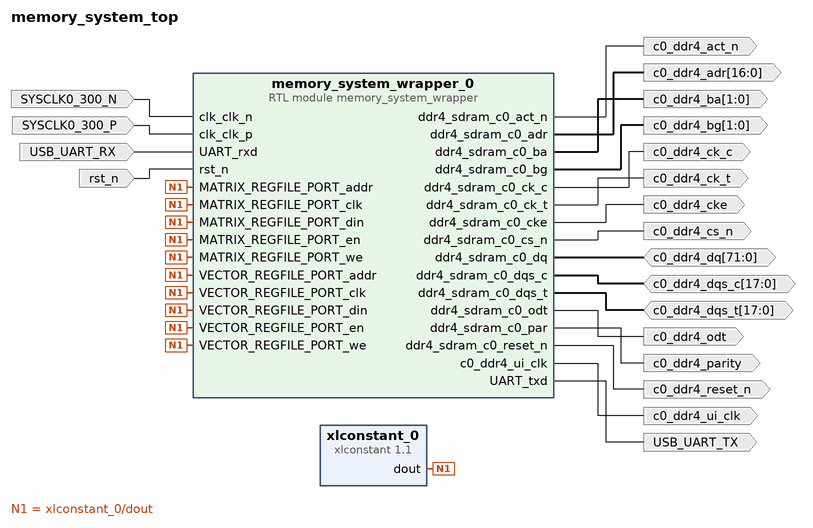
[diagram p0: block diagram of the top level]
# Vivado block design memory_system_top, xcu250-figd2104-2L-e, Vivado 2024.1
create_bd_design memory_system_top

create_bd_port -dir I USB_UART_RX
create_bd_port -dir O USB_UART_TX
create_bd_port -dir I -type clk SYSCLK0_300_N
set_property -dict {CONFIG.ASSOCIATED_RESET rst_n CONFIG.FREQ_HZ 300000000} [get_bd_ports SYSCLK0_300_N]
create_bd_port -dir I -type clk SYSCLK0_300_P
set_property -dict {CONFIG.ASSOCIATED_RESET rst_n:rst_n CONFIG.FREQ_HZ 300000000} [get_bd_ports SYSCLK0_300_P]
create_bd_port -dir I -type rst rst_n
create_bd_port -dir IO -from 71 -to 0 c0_ddr4_dq
create_bd_port -dir IO -from 17 -to 0 c0_ddr4_dqs_c
create_bd_port -dir O c0_ddr4_parity
create_bd_port -dir O c0_ddr4_reset_n
create_bd_port -dir O -from 1 -to 0 c0_ddr4_ba
create_bd_port -dir O -from 1 -to 0 c0_ddr4_bg
create_bd_port -dir O c0_ddr4_cke
create_bd_port -dir O -from 16 -to 0 c0_ddr4_adr
create_bd_port -dir O c0_ddr4_cs_n
create_bd_port -dir O c0_ddr4_ck_c
create_bd_port -dir O c0_ddr4_ck_t
create_bd_port -dir O c0_ddr4_odt
create_bd_port -dir IO -from 17 -to 0 c0_ddr4_dqs_t
create_bd_port -dir O c0_ddr4_act_n
create_bd_port -dir O -type clk c0_ddr4_ui_clk

create_bd_cell -type ip -vlnv xilinx.com:ip:xlconstant:1.1 xlconstant_0
set_property -dict {CONFIG.CONST_VAL 0 CONFIG.CONST_WIDTH 4096} [get_bd_cells xlconstant_0]
create_bd_cell -type module -reference memory_system_wrapper memory_system_wrapper_0

# ---- connections ----

connect_bd_net [get_bd_ports c0_ddr4_dq] [get_bd_pins memory_system_wrapper_0/ddr4_sdram_c0_dq]
connect_bd_net [get_bd_ports c0_ddr4_dqs_c] [get_bd_pins memory_system_wrapper_0/ddr4_sdram_c0_dqs_c]
connect_bd_net [get_bd_ports c0_ddr4_dqs_t] [get_bd_pins memory_system_wrapper_0/ddr4_sdram_c0_dqs_t]
connect_bd_net [get_bd_ports SYSCLK0_300_N] [get_bd_pins memory_system_wrapper_0/clk_clk_n]
connect_bd_net [get_bd_ports SYSCLK0_300_P] [get_bd_pins memory_system_wrapper_0/clk_clk_p]
connect_bd_net [get_bd_ports USB_UART_RX] [get_bd_pins memory_system_wrapper_0/UART_rxd]
connect_bd_net [get_bd_pins memory_system_wrapper_0/UART_txd] [get_bd_ports USB_UART_TX]
connect_bd_net [get_bd_pins memory_system_wrapper_0/c0_ddr4_ui_clk] [get_bd_ports c0_ddr4_ui_clk]
connect_bd_net [get_bd_pins memory_system_wrapper_0/ddr4_sdram_c0_act_n] [get_bd_ports c0_ddr4_act_n]
connect_bd_net [get_bd_pins memory_system_wrapper_0/ddr4_sdram_c0_adr] [get_bd_ports c0_ddr4_adr]
connect_bd_net [get_bd_pins memory_system_wrapper_0/ddr4_sdram_c0_ba] [get_bd_ports c0_ddr4_ba]
connect_bd_net [get_bd_pins memory_system_wrapper_0/ddr4_sdram_c0_bg] [get_bd_ports c0_ddr4_bg]
connect_bd_net [get_bd_pins memory_system_wrapper_0/ddr4_sdram_c0_ck_c] [get_bd_ports c0_ddr4_ck_c]
connect_bd_net [get_bd_pins memory_system_wrapper_0/ddr4_sdram_c0_ck_t] [get_bd_ports c0_ddr4_ck_t]
connect_bd_net [get_bd_pins memory_system_wrapper_0/ddr4_sdram_c0_cke] [get_bd_ports c0_ddr4_cke]
connect_bd_net [get_bd_pins memory_system_wrapper_0/ddr4_sdram_c0_cs_n] [get_bd_ports c0_ddr4_cs_n]
connect_bd_net [get_bd_pins memory_system_wrapper_0/ddr4_sdram_c0_odt] [get_bd_ports c0_ddr4_odt]
connect_bd_net [get_bd_pins memory_system_wrapper_0/ddr4_sdram_c0_par] [get_bd_ports c0_ddr4_parity]
connect_bd_net [get_bd_pins memory_system_wrapper_0/ddr4_sdram_c0_reset_n] [get_bd_ports c0_ddr4_reset_n]
connect_bd_net [get_bd_ports rst_n] [get_bd_pins memory_system_wrapper_0/rst_n]
connect_bd_net [get_bd_pins xlconstant_0/dout] \
  [get_bd_pins memory_system_wrapper_0/MATRIX_REGFILE_PORT_addr] \
  [get_bd_pins memory_system_wrapper_0/MATRIX_REGFILE_PORT_din] [get_bd_pins memory_system_wrapper_0/MATRIX_REGFILE_PORT_clk] \
  [get_bd_pins memory_system_wrapper_0/MATRIX_REGFILE_PORT_en] [get_bd_pins memory_system_wrapper_0/MATRIX_REGFILE_PORT_we] \
  [get_bd_pins memory_system_wrapper_0/VECTOR_REGFILE_PORT_addr] \
  [get_bd_pins memory_system_wrapper_0/VECTOR_REGFILE_PORT_clk] [get_bd_pins memory_system_wrapper_0/VECTOR_REGFILE_PORT_din] \
  [get_bd_pins memory_system_wrapper_0/VECTOR_REGFILE_PORT_en] [get_bd_pins memory_system_wrapper_0/VECTOR_REGFILE_PORT_we]

validate_bd_design
save_bd_design
